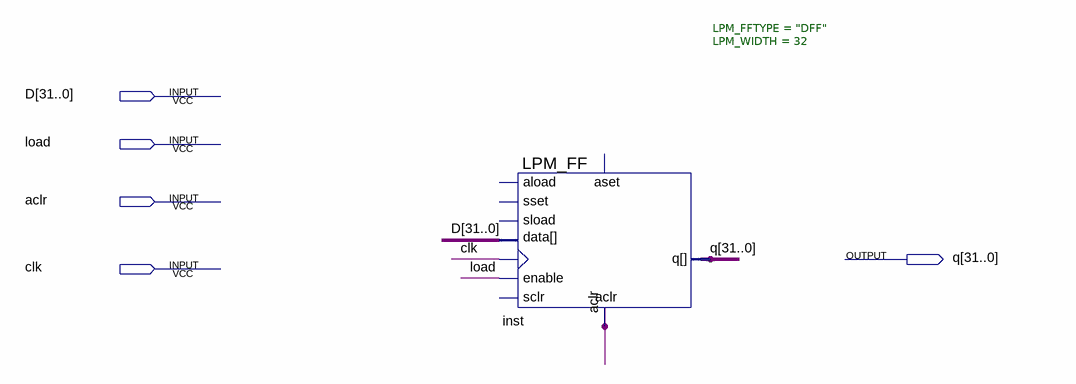
[diagram p0: schematic sheet]
// Quartus schematic r1.bdf as structural Verilog: 1 symbols, 5 pins
module r1 (
  input  [31:0] D,
  input  load,
  input  aclr,
  input  clk,
  output [31:0] q
);

  LPM_FF #(.LPM_FFTYPE("DFF"), .LPM_WIDTH(32)) inst (
    .enable(load), .clock(clk), .aclr(aclr), .data(D), .q(q));  // open: aload, sset, sload, aset, sclr
endmodule
